# Altium schematic sheet 05_DISPLAY & QTouch.SchDoc
size 420 x 297 mm
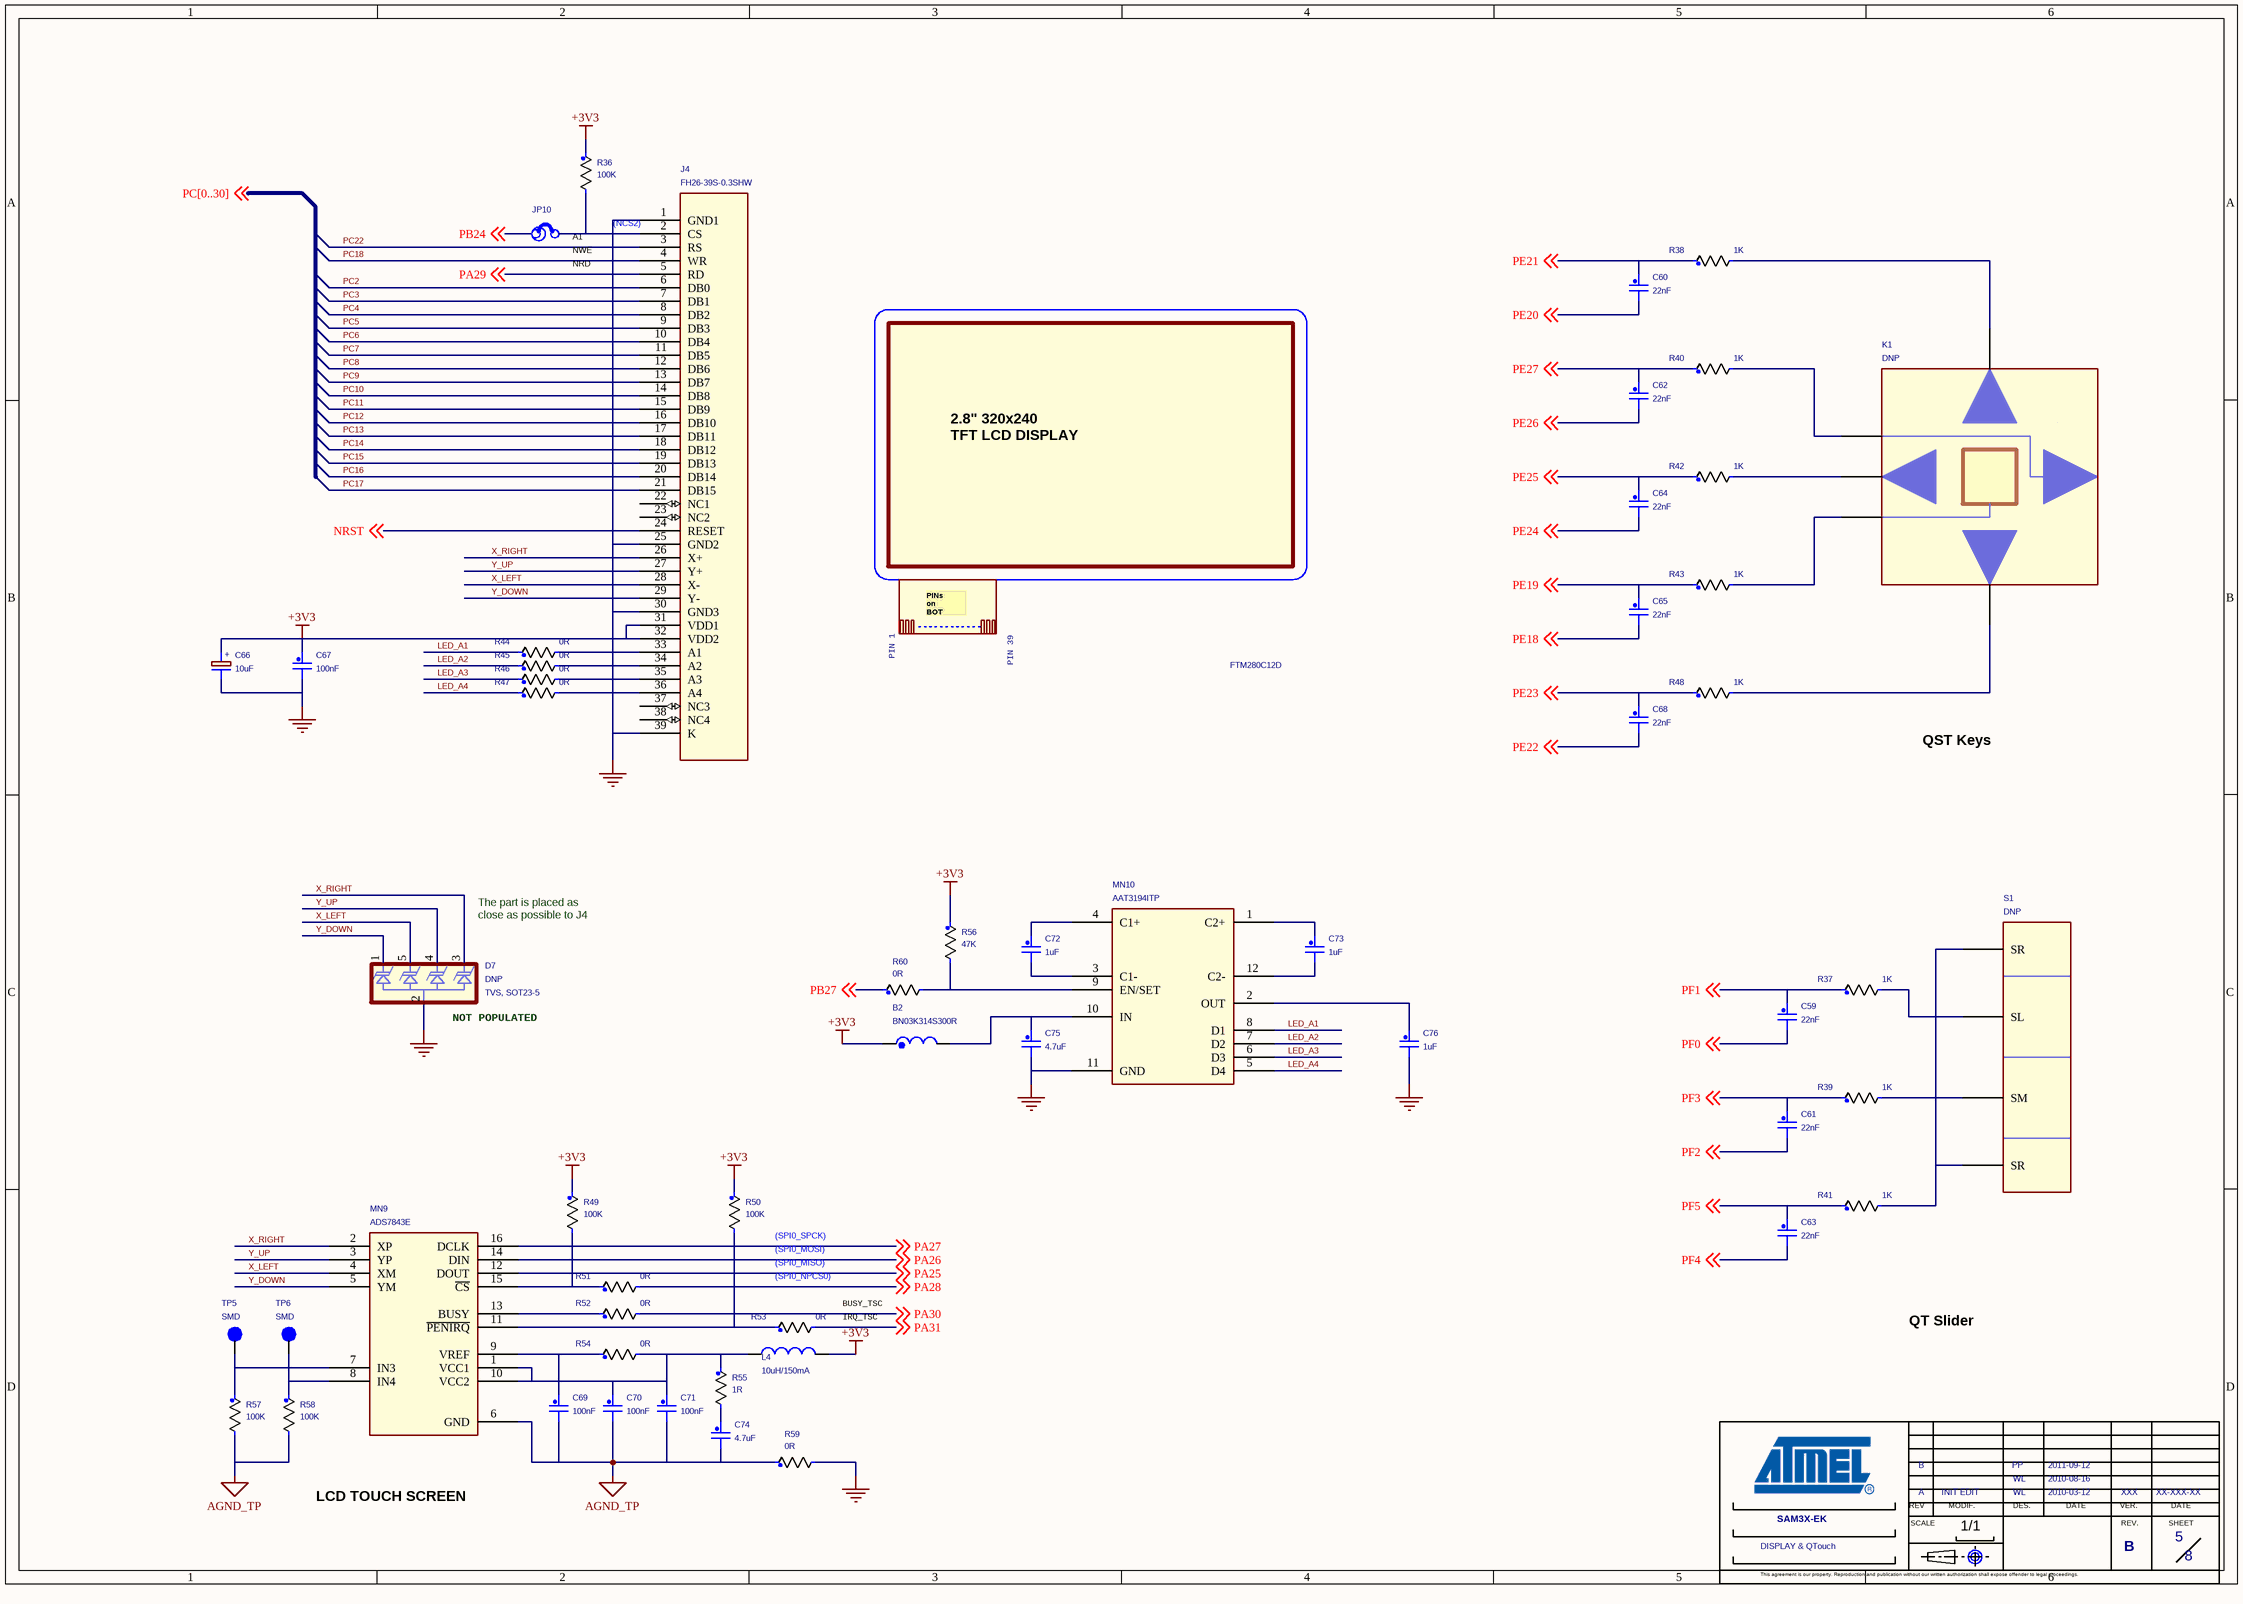
[diagram p0: 05_DISPLAY & QTouch.SchDoc]

## Parts
*  SHEET NAME 1: DISPLAY & QTouch  REV C: B  VERIF A: XXX  VERIF DATE A: XX-XXX-XX  Page Count: 8  Page Number: 5  DATE A: 2010-03-12  DATE B: 2010-08-16  DATE C: 2011-09-12  DES A: WL  DES C: PP  BOARD NAME: SAM3X-EK  VERSION: A  MODIF. DESCRIBE: INIT EDIT  (hidden comment: ATMEL ARM)  (graphical)
B2  BN03K314S300R  [R0603]
C59  22nF  [CAP0805]
C60  22nF  [CAP0805]
C61  22nF  [CAP0805]
C62  22nF  [CAP0805]
C63  22nF  [CAP0805]
C64  22nF  [CAP0805]
C65  22nF  [CAP0805]
C66  10uF  [C3216-18]
C67  100nF  [CAP0805]
C68  22nF  [CAP0805]
C69  100nF  [CAP0805]
C70  100nF  [CAP0805]
C71  100nF  [CAP0805]
C72  1uF  [CAP0805]
C73  1uF  [CAP0805]
C74  4.7uF  [CAP0805]
C75  4.7uF  [CAP0805]
C76  1uF  [CAP0805]
D7  DNP  Note: TVS, SOT23-5  [SOT23-5]
J4  FH26-39S-0.3SHW  [FH26_39S_03SHW]
JP10  JP  [BAR2PTS02]  (value not drawn)
K1  DNP  [qkeys]
L4  10uH/150mA  [NLFV25T]
MN9  ADS7843E  [SSOP16]
MN10  AAT3194ITP  [TSOPJW-12]
R36  100K  [R0603]
R37  1K  [r0603]
R38  1K  [r0603]
R39  1K  [r0603]
R40  1K  [r0603]
R41  1K  [r0603]
R42  1K  [r0603]
R43  1K  [r0603]
R44  0R  [R0603]
R45  0R  [R0603]
R46  0R  [R0603]
R47  0R  [R0603]
R48  1K  [r0603]
R49  100K  [r0603]
R50  100K  [r0603]
R51  0R  [r0603]
R52  0R  [r0603]
R53  0R  [r0603]
R54  0R  [r0603]
R55  1R  [r0603]
R56  47K  [R0603]
R57  100K  [r0603]
R58  100K  [r0603]
R59  0R  [r0603]
R60  0R  [R0603]
S1  DNP  [E1106]
SH16  Jumper Pitch 2.54  [JUMPER-2.54]  (value not drawn)
TP5  SMD  [P1A]
TP6  SMD  [P1A]
Z8  VAL: FTM280C12D  [Mechanic]  (hidden comment: LB043WQ1)

## Nets
+3V3: B2.1 C66.1 C67.1 J4.31(VDD1) J4.32(VDD2) L4.1 R36.1 R49.1 R50.1 R56.1
AGND_TP: C69.2 C70.2 C71.2 C74.2 MN9.6(GND) R57.2 R58.2 R59.1
GND_POWER: C66.2 C67.2 C75.2 C76.2 D7.2(COM) J4.1(GND1) J4.25(GND2) J4.30(GND3) J4.39(K) MN10.11(GND) R59.2
LED_A1: MN10.8(D1) R44.1
LED_A2: MN10.7(D2) R45.1
LED_A3: MN10.6(D3) R46.1
LED_A4: MN10.5(D4) R47.1
NRST: J4.24(RESET) ; off-sheet NRST
PA25: MN9.12(DOUT) ; off-sheet PA25
PA26: MN9.14(DIN) ; off-sheet PA26
PA27: MN9.16(DCLK) ; off-sheet PA27
PA28: R51.2 ; off-sheet PA28
PA29: J4.5(RD) ; off-sheet PA29
PA30: R52.2 ; off-sheet PA30
PA31: R53.2 ; off-sheet PA31
PB24: JP10.1 ; off-sheet PB24
PB27: R60.1 ; off-sheet PB27
PC2: J4.6(DB0)
PC3: J4.7(DB1)
PC4: J4.8(DB2)
PC5: J4.9(DB3)
PC6: J4.10(DB4)
PC7: J4.11(DB5)
PC8: J4.12(DB6)
PC9: J4.13(DB7)
PC10: J4.14(DB8)
PC11: J4.15(DB9)
PC12: J4.16(DB10)
PC13: J4.17(DB11)
PC14: J4.18(DB12)
PC15: J4.19(DB13)
PC16: J4.20(DB14)
PC17: J4.21(DB15)
PC18: J4.4(WR)
PC22: J4.3(RS)
PE18: C65.2 ; off-sheet PE18
PE19: C65.1 R43.1 ; off-sheet PE19
PE20: C60.2 ; off-sheet PE20
PE21: C60.1 R38.1 ; off-sheet PE21
PE22: C68.2 ; off-sheet PE22
PE23: C68.1 R48.1 ; off-sheet PE23
PE24: C64.2 ; off-sheet PE24
PE25: C64.1 R42.1 ; off-sheet PE25
PE26: C62.2 ; off-sheet PE26
PE27: C62.1 R40.1 ; off-sheet PE27
PF0: C59.2 ; off-sheet PF0
PF1: C59.1 R37.1 ; off-sheet PF1
PF2: C61.2 ; off-sheet PF2
PF3: C61.1 R39.1 ; off-sheet PF3
PF4: C63.2 ; off-sheet PF4
PF5: C63.1 R41.1 ; off-sheet PF5
X_LEFT: D7.5(K4) J4.28(X-) MN9.4(XM)
X_RIGHT: D7.3(K2) J4.26(X+) MN9.2(XP)
Y_DOWN: D7.1(K1) J4.29(Y-) MN9.5(YM)
Y_UP: D7.4(K3) J4.27(Y+) MN9.3(YP)
NetB2_2: B2.2 C75.1 MN10.10(IN)
NetC69_1: C69.1 MN9.9(VREF) R54.1
NetC70_1: C70.1 C71.1 L4.2 MN9.1(VCC1) MN9.10(VCC2) R54.2 R55.1
NetC72_1: C72.1 MN10.4(C1+)
NetC72_2: C72.2 MN10.3(C1-)
NetC73_1: C73.1 MN10.1(C2+)
NetC73_2: C73.2 MN10.12(C2-)
NetC74_1: C74.1 R55.2
NetC76_1: C76.1 MN10.2(OUT)
NetJ4_2: J4.2(CS) JP10.2 R36.2
NetJ4_33: J4.33(A1) R44.2
NetJ4_34: J4.34(A2) R45.2
NetJ4_35: J4.35(A3) R46.2
NetJ4_36: J4.36(A4) R47.2
NetK1_1: K1.1 R38.2
NetK1_2: K1.2 R40.2
NetK1_3: K1.3 R42.2
NetK1_4: K1.4 R43.2
NetK1_5: K1.5 R48.2
NetMN9_7: MN9.7(IN3) R57.1 TP5.1(TP)
NetMN9_8: MN9.8(IN4) R58.1 TP6.1(TP)
NetMN9_11: MN9.11(~{PENIRQ}) R50.2 R53.1
NetMN9_13: MN9.13(BUSY) R52.1
NetMN9_15: MN9.15(~{CS}) R49.2 R51.1
NetMN10_9: MN10.9(EN/SET) R56.2 R60.2
NetR37_2: R37.2 S1.2(SL)
NetR39_2: R39.2 S1.3(SM)
NetR41_2: R41.2 S1.1(SR) S1.4(SR)

Not connected (* = marked no-connect by the designer): J4 22(NC1) 23(NC2) 37(NC3) 38(NC4)

## Notes on the sheet
- (near JP10) A1
- (near JP10) NWE
- (NCS2)
- (near JP10) NRD
- 2.8" 320x240
  TFT LCD DISPLAY
- QST Keys
- (near D7) The part is placed as
  close as possible to J4
- (near D7) NOT POPULATED
- (near R50) (SPI0_MOSI)
- (near R50) (SPI0_SPCK)
- (SPI0_MISO)
- (SPI0_NPCS0)
- IRQ_TSC
- BUSY_TSC
- QT Slider
- LCD TOUCH SCREEN
- (in symbol ATMEL ARM) REV; MODIF.; DES.; DATE; VER.; SCALE; REV.; SHEET; 1/1; This agreement is our property. Reproduction and publication without our written authorization shall expose offender to legal proceedings.
- (in symbol CAP_PN) +
- (in symbol display_LB043WQ1_3) PINs / on / BOT; PIN 1; PIN 39

## Library data of the parts
* = ATMEL ARM: REV D: D; REV F: F; REV E: E; REV B: B; VERIF F: XXX; VERIF E: XXX; VERIF D: XXX; VERIF C: XXX; VERIF B: XXX; VERIF DATE F: XX-XXX-XX; VERIF DATE E: XX-XXX-XX; VERIF DATE D: XX-XXX-XX; VERIF DATE C: XX-XXX-XX; REV: B; VERIF DATE B: XX-XXX-XX; FT: ?; Page Size: A; Page Create Date: june 19, 2004; DATE D: XX-XXX-XX; DATE E: XX-XXX-XX; DATE F: XX-XXX-XX; DES E: XXX; DES F: XXX; DES B: WL; DES D: XXX
B2 = BEAD: BOI: 0603; DESIG: SMD EMI Suppression Ferrite Beads; FAB: GAUSSTEK GARP; REF: BN03K314S300R; VAL: BN03K314S300R
C59 C60 C63 C64 C68 = C_Generic: Toler.: 10%; P/N #1: C0603C104K4RAC; Voltage: 16V; Mfg #1: KEMET; Dielectric: X7R; BOI: 0603; DESIG: Ceramic Capacitor; DEV: C0603; FAB: TDK; REF: C1608X7R1C223KT; VAL: 22nF; TEN: 16V; TOL: 10%
C61 C62 C65 = C_Generic: Toler.: 10%; P/N #1: C0603C104K4RAC; Voltage: 16V; Mfg #1: KEMET; Dielectric: X7R; REF: C1608X7R1C223KT; FAB: TDK; DEV: C0603; DESIG: Ceramic Capacitor; BOI: 0603; TOL: 10%; TEN: 16V; VAL: 22nF
C66 = CAP_PN: SDTSourceLibName: C:\WINDOWS\TEMP\SNDS.LIB; BOI: A; DESIG: LOW ESR TANTALUM CAPACITOR; DEV: 3216; FAB: AVX; REF: TPSA106K010R1800; TEN: 10V; TOL: 10%; Dielectric: X5R; VAL: 10uF
C67 C69-C71 = C_Generic: Toler.: 10%; P/N #1: C0603C104K4RAC; Voltage: 16V; Mfg #1: KEMET; Dielectric: X7R; REF: C1608X7R1C104KT; FAB: TDK; DEV: C0603; DESIG: Ceramic Capacitor; BOI: 0603; TOL: 10%; TEN: 16V; VAL: 100nF
C72 C73 C76 = C_Generic: Toler.: 10%; P/N #1: C0603C104K4RAC; Voltage: 16V; Mfg #1: KEMET; Dielectric: X5R; TEN: 50V; REF: C1608X5R1H105KT; FAB: TDK; DEV: C0603; DESIG: X5R CERAMIC CAPACITOR; BOI: 0603; TOL: 10%; VAL: 1uF
C74 C75 = C_Generic: Toler.: 10%; P/N #1: C0603C104K4RAC; Voltage: 16V; Mfg #1: KEMET; Dielectric: X5R; REF: C2012X5R1C475KT; FAB: TDK; DEV: C0805; DESIG: X5R CERAMIC CAPACITOR; BOI: 0805; TOL: 10%; TEN: 16V; VAL: 4.7uF
D7 = PACDN: FAB: California Micro Devices; DESIG: ESD Protectors; REF: PACDN044Y5R; BOI: SOT23-5; DEV: SOT23-5; VAL: PACDN044Y5R
J4 = FH26-39S: FAB: HRS; REF: FH26-39S-0.3SHW
JP10 = JUMP_0: DESIG: 2.54mm Pin Header,Single Row,Straight/Right Angle(2pin); FAB: SHENZHEN SITUO; REF: 045; VAL: 045
K1 = keys: DESIG: QTouch Key; Val: NOT POPULATED
L4 = L_0: DESIG: Inductor; FAB: TDK; REF: NLFV25T-100K; VAL: 10uH/150mA
MN9 = ADS7843E: BOI: SSOP-16; DESIG: TOUCH SCREEN CONTROLLER; FAB: TI; DEV: SSOP-16; REF: ADS7843E; VAL: ADS7843E
MN10 = AAT3194: VAL: AAT3194ITP-20-T1; FAB: ANALOGIC TECH; DESIG: Charge Pump For White LED Applications; REF: AAT3194ITP-20-T1; DEV: TSOPJW-12; BOI: TSOPJW-12
R36 R49 R50 = R_Generic: P/N #1: CR10-1001F-T; TOL: 5%; REF: RC0603JR-07100KL; FAB: YAGEO; DESIG: RC21 5%; BOI: 0603; VAL: 100K; DEV: R0603
R37-R40 R48 = R_Generic: P/N #1: CR10-1001F-T; TOL: 5%; REF: RC0603JR-071KL; FAB: YAGEO; DESIG: RC21 5%; BOI: 0603; VAL: 1K; DEV: R0603
R41-R43 = R_Generic: P/N #1: CR10-1001F-T; BOI: 0603; DESIG: RC21 5%; FAB: YAGEO; REF: RC0603JR-071KL; TOL: 5%; DEV: R0603; VAL: 1K
R44 R46 R52 R54 R59 R60 = R_Generic: P/N #1: CR10-1001F-T; TOL: 5%; REF: RC0603JR-070RL; FAB: YAGEO; DESIG: RC21 5%; BOI: 0603; VAL: 0R; DEV: R0603
R45 R47 R51 R53 = R_Generic: P/N #1: CR10-1001F-T; BOI: 0603; DESIG: RC21 5%; FAB: YAGEO; REF: RC0603JR-070RL; TOL: 5%; DEV: R0603; VAL: 0R
R55 = R_Generic: P/N #1: CR10-1001F-T; TOL: 5%; REF: RC0603JR-071RL; FAB: YAGEO; DESIG: RC21 5%; BOI: 0603; VAL: 1R; DEV: R0603
R56 = R_Generic: P/N #1: CR10-1001F-T; TOL: 5%; REF: RC0603JR-0747KL; FAB: YAGEO; DESIG: RC21 5%; BOI: 0603; VAL: 47K; DEV: R0603
R57 R58 = R_Generic: P/N #1: CR10-1001F-T; BOI: 0603; DESIG: RC21 5%; FAB: YAGEO; REF: RC0603JR-07100KL; TOL: 5%; DEV: R0603; VAL: 100K
S1 = QSlider_0: DESIG: QTouch Slider; Val: NOT POPULATED
SH16 = JUMPER-2.54: Jumper,2 Points Jumper Pitch 2.54; Part Number: 440-00002-1; Manufacturer: WIESON; Manufacturer Part Number: G4160-1A60BF1U; FAB: NA; REF: JUMPER 2.54; DESIG: 2 POINTS JUMPER PITCH 2.54; VAL: JUMPER 2.54; BOI: NA; Part Type: Jumper
TP5 = TP: VAL: NOT POPULATED; REF: NA; DESIG: testing PAD; FAB: NA
TP6 = TP: DESIG: testing PAD; FAB: NA; VAL: NOT POPULATED; REF: NA
Z8 = display_LB043WQ1_3: REF: LB043WQ1